# EasyEDA Pro project ProPrj_智能视觉集成板-V3.0.epro, schematic Schematic2_1
Board Name: Board1; Create Date: 2024-11-29; Page Name: P1; Project Name: 3D模型; Schematic Name: Schematic2; Update Date: 2024-12-16; Company: 嘉立创EDA; Page Size: A4; Version: V1.0
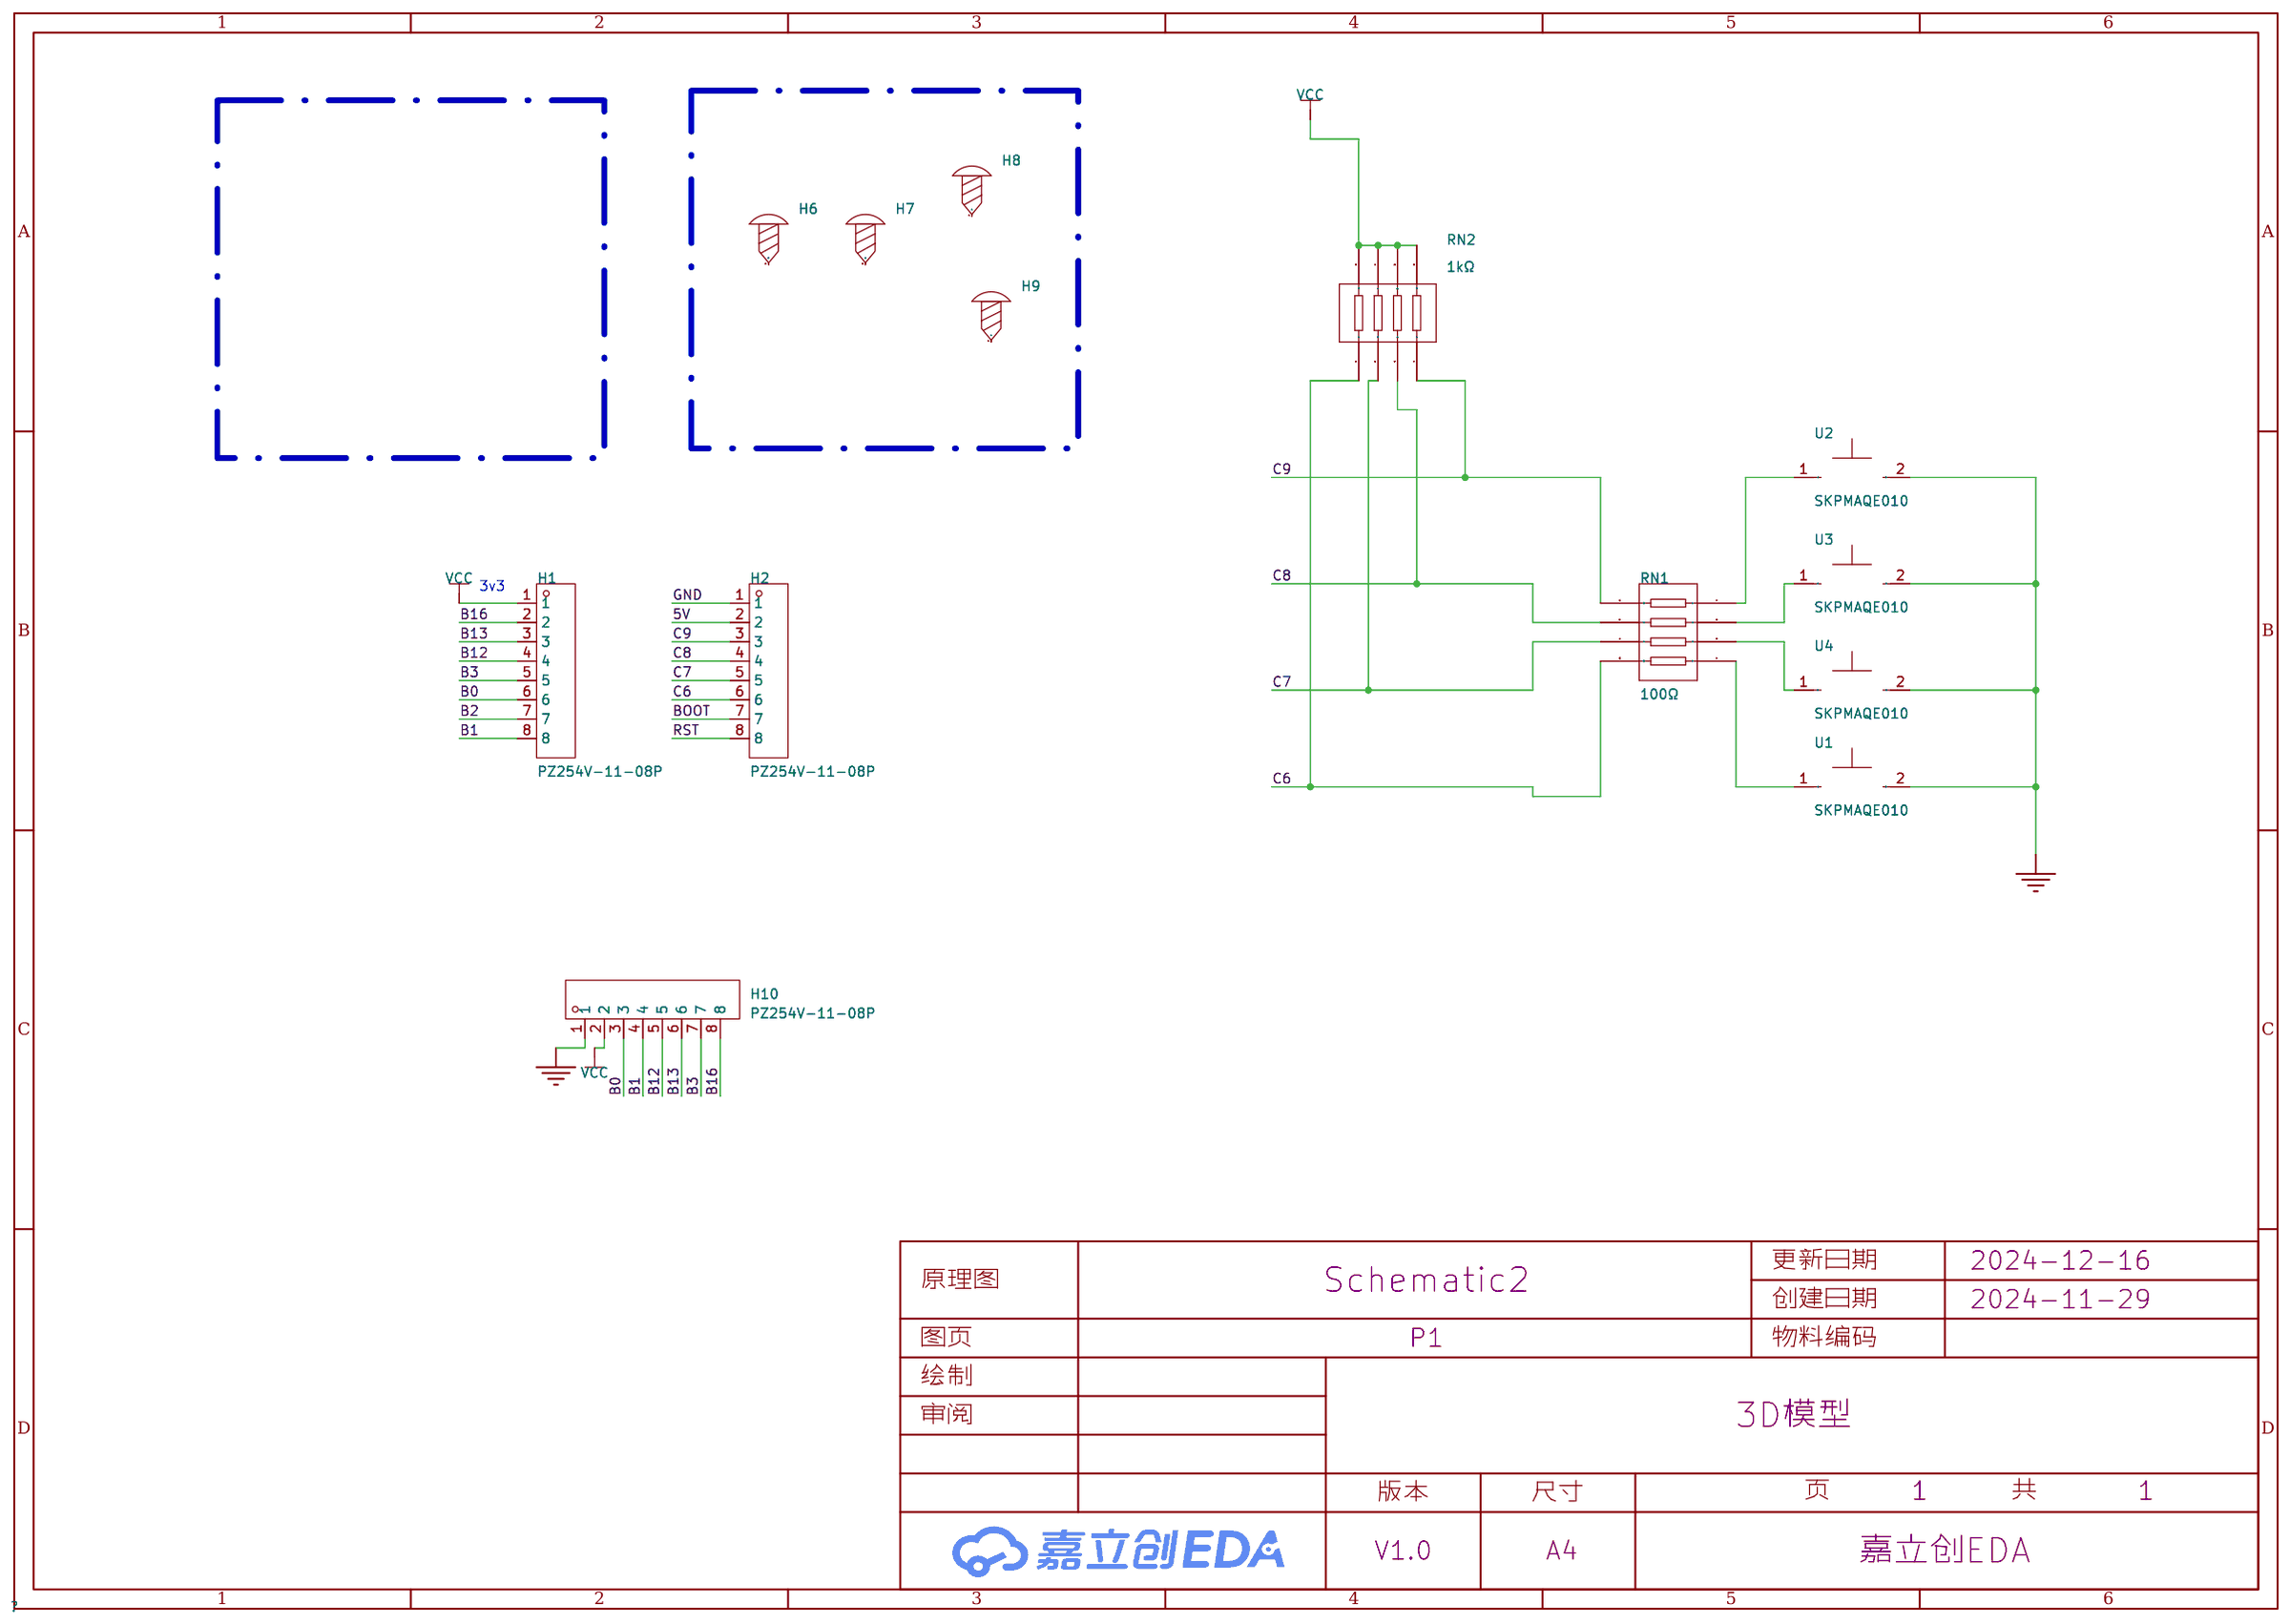
[diagram p7: schematic sheet]

## Parts
H1  PZ254V-11-08P  [HDR-TH_8P-P2.54-V-M]
H2  PZ254V-11-08P  [HDR-TH_8P-P2.54-V-M]
H6  -  [Screw_R2.2mm]
H7  -  [Screw_R2.2mm]
H8  -  [Screw_R2.2mm]
H9  -  [Screw_R2.2mm]
H10  PZ254V-11-08P  [HDR-TH_8P-P2.54-V-M]
RN1  100Ω  [RES-ARRAY-SMD_0603-8P-L3.2-W1.6-BL]
RN2  1kΩ  [RES-ARRAY-SMD_0603-8P-L3.2-W1.6-BL]
U1  SKPMAQE010  [KEY-SMD_2P-L6.0-W6.0-P6.00]
U2  SKPMAQE010  [KEY-SMD_2P-L6.0-W6.0-P6.00]
U3  SKPMAQE010  [KEY-SMD_2P-L6.0-W6.0-P6.00]
U4  SKPMAQE010  [KEY-SMD_2P-L6.0-W6.0-P6.00]

## Library data of the parts
H1 H2 H10 = PZ254V-11-08P: 插针结构:1x8P;间距:2.54mm;行距:-;圆针/方针:方针;安装类型:直插;排数:单排;总PIN位数:8P;额定电流:-;额定电压:-;配合针长度:6mm;塑高:2.5mm;端接针长度:3mm;触头材质:黄铜;触头镀层:-;工作温度范围:-40℃~+105℃;颜色:黑色;; LCSC Part Name: 间距:2.54mm 1x8P 直插 方针; Supplier Part: C492407; Manufacturer: XFCN(兴飞); Supplier Footprint: 插件,P=2.54mm; JLCPCB Part Class: 扩展库; Datasheet: https://atta.szlcsc.com/upload/public/pdf/source/20200309/C492407_83A6FB26A2233368EDB9516968EC6149.pdf; Supplier: LCSC; Pin Structure: 1x8P; Pitch: 2.54mm; Circluar Pins/Square Pins: 方针; Mounting Type: 直插; Number of Rows: 单排; Number of Pins: 8P; Length of Mating Pin: 6mm; Insulation Height: 2.5mm; Length of End Connection Pin: 3mm; Contact Material: 黄铜; Operating Temperature Range: -40℃~+105℃; Color: 黑色
H6-H9 = Screw_M2
RN1 = 4D03WGJ0101T5E: 电阻器数:4;阻值:100Ω;精度:±5%;单个元件功率:62.5mW;温度系数:±200ppm/℃;; LCSC Part Name: 100Ω ±5%; Supplier Part: C25506; Manufacturer: UNI-ROYAL(厚声); Supplier Footprint: 0603x4; JLCPCB Part Class: Extended Part; Datasheet: https://atta.szlcsc.com/upload/public/pdf/source/20191224/C474318_2527498AE30E813171187CCD28401A71.pdf; Supplier: LCSC; Number of Resistors: 4; Tolerance: ±5%; Power(Watts): 62.5mW; Temperature Coefficient: ±200ppm/℃; Number of Pins: 8
RN2 = YC164-FR-071KL: 电阻器数:4;阻值:1kΩ;精度:±1%;单个元件功率:62.5mW;温度系数:±200ppm/℃;; LCSC Part Name: 1kΩ ±1%; Supplier Part: C110021; Manufacturer: YAGEO(国巨); Supplier Footprint: 0603x4; JLCPCB Part Class: 扩展库; Datasheet: https://atta.szlcsc.com/upload/public/pdf/source/20170428/1493376791474.pdf; Supplier: LCSC; Number of Resistors: 4; Tolerance: ±1%; Power(Watts): 62.5mW; Temperature Coefficient: ±200ppm/℃; Number of Pins: 8
U1-U4 = SKPMAQE010: 6*6*5mm 立贴 硅胶软开关 无声静音开关 电路结构:单刀单掷 触点电流:50mA 额定电压(DC):16V 安装方式:立贴 动作力:3.5N 操作寿命:5万次 行程:1.3mm 用途:汽车音响,汽车导航,音响设备,手持设备,通讯设备,测量仪器等各种操作; Supplier Part: C19274389; Manufacturer: ALPSALPINE(阿尔卑斯阿尔派); Supplier Footprint: SMD,6.6x6mm; JLCPCB Part Class: 扩展库; Datasheet: https://atta.szlcsc.com/upload/public/pdf/source/20231201/D724ADF6978EA66A095344C51B88B412.pdf; Supplier: LCSC

## Nets
5V: H2.2
GND: H2.1 H10.1 U1.2 U2.2 U3.2 U4.2
VCC: H1.1 H10.2 RN2.5 RN2.6 RN2.7 RN2.8
B0: H1.6 H10.3
B1: H1.8 H10.4
B2: H1.7
B3: H1.5 H10.7
B12: H1.4 H10.5
B13: H1.3 H10.6
B16: H1.2 H10.8
BOOT: H2.7
C6: H2.6 RN1.8 RN2.1
C7: H2.5 RN1.7 RN2.2
C8: H2.4 RN1.6 RN2.3
C9: H2.3 RN1.5 RN2.4
RST: H2.8
$1N1420: RN1.4 U2.1
$1N1427: RN1.3 U3.1
$1N1432: RN1.2 U4.1
$1N1437: RN1.1 U1.1

Not connected (* = marked no-connect by the designer): H6 1; H7 1; H8 1; H9 1

## Notes on the sheet
- 3v3
